# EAGLE design DAC_GainOutputStage4 (EAGLE 9.6.2)
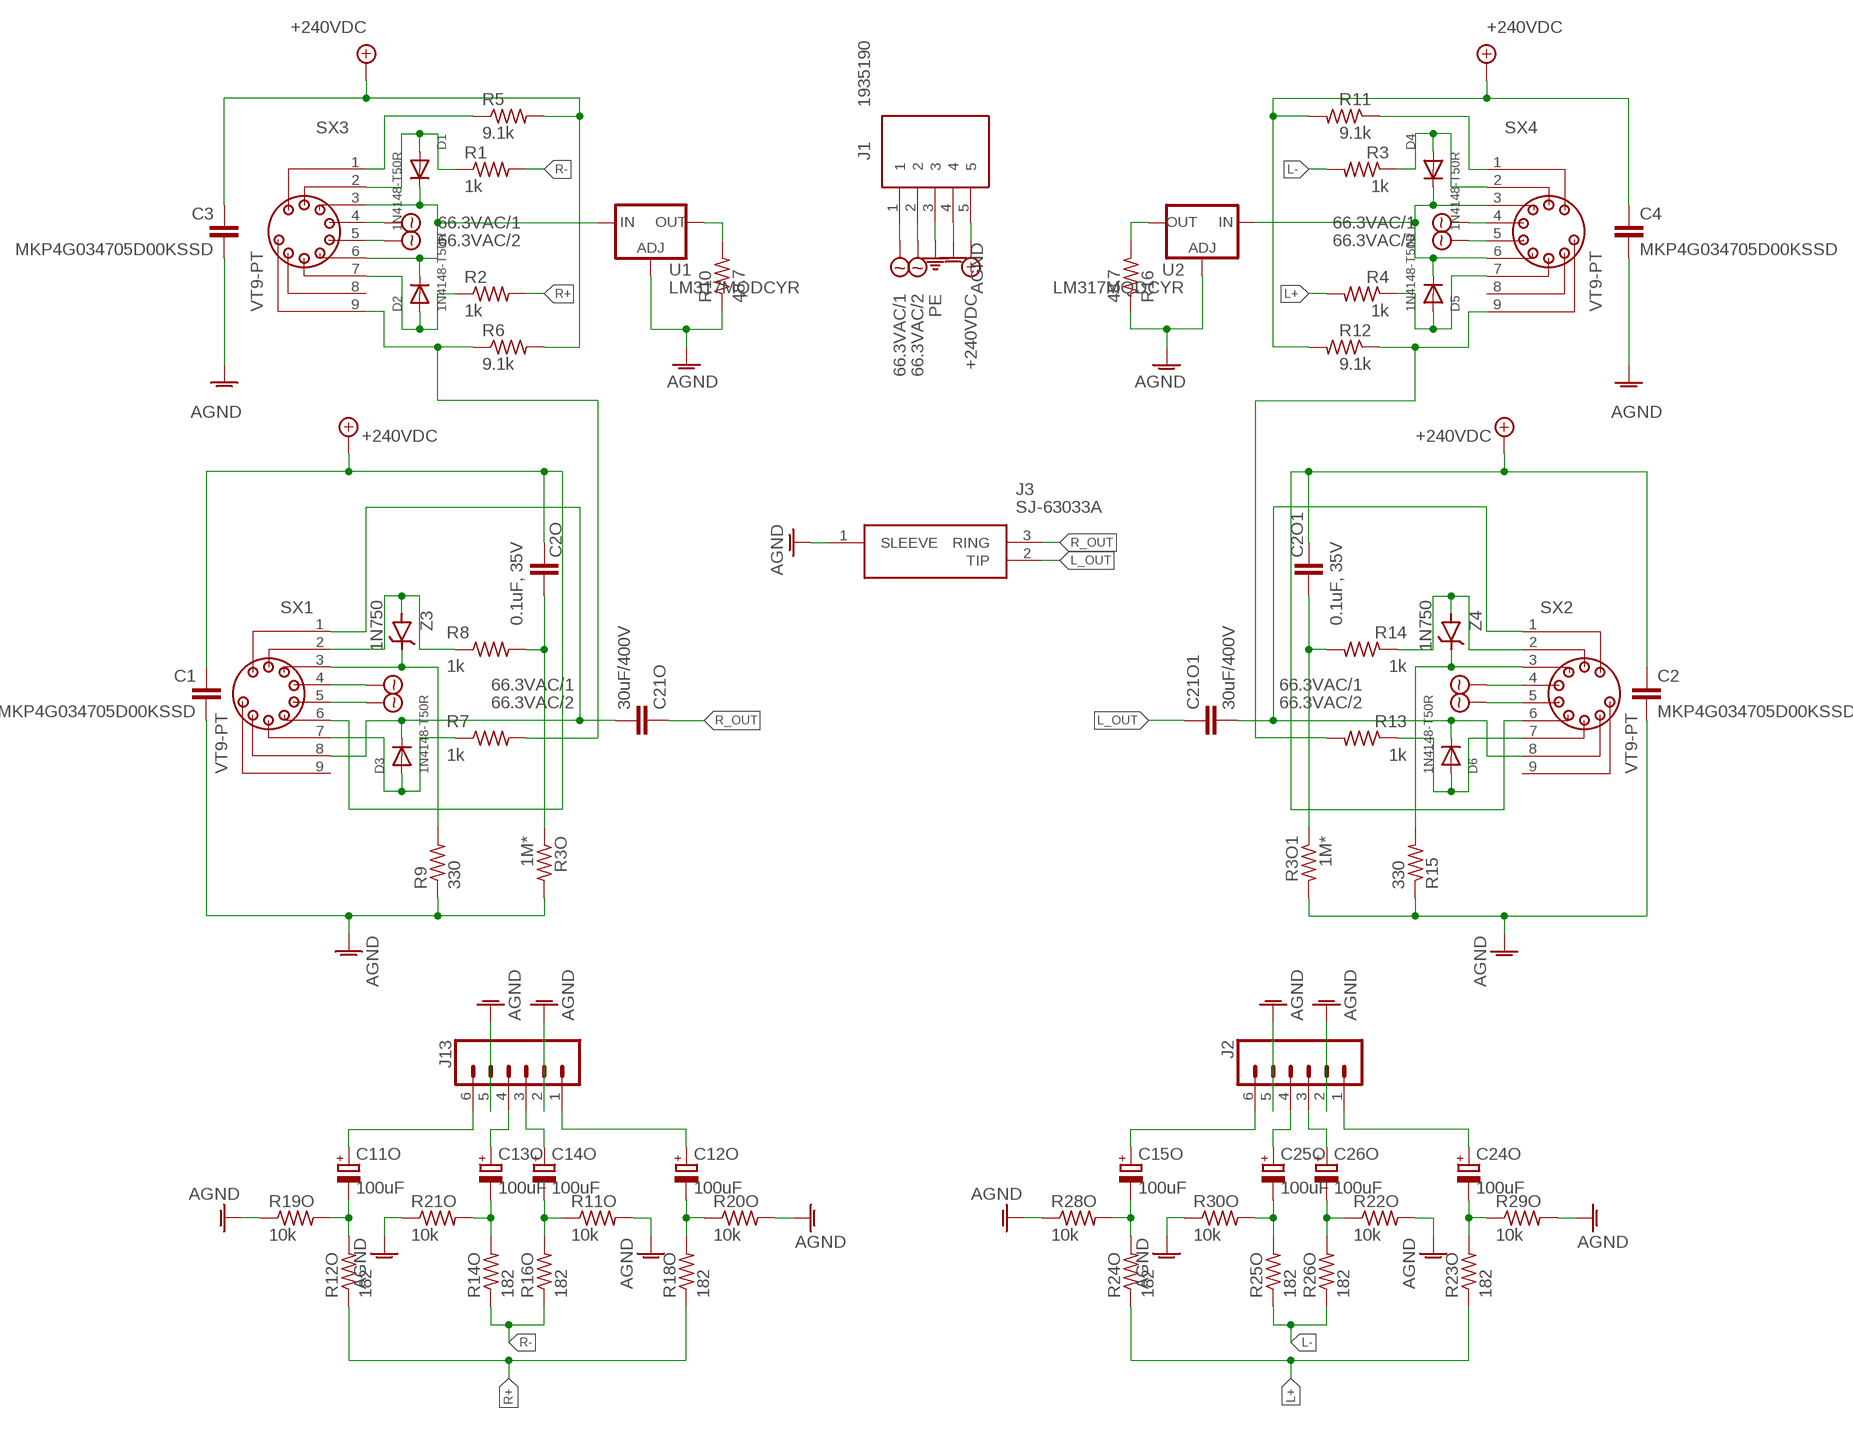
[diagram p0: schematic, sheet 1]

## Parts
C1  MKP4G034705D00KSSD  [MKP4G034705D00KSSD]
C2  MKP4G034705D00KSSD  [MKP4G034705D00KSSD]
C2O  0.1uF, 35V  MKS4B031002A00JC00  [MKS4B031002A00JC00]
C2O1  0.1uF, 35V  MKS4B031002A00JC00  [MKS4B031002A00JC00]
C3  MKP4G034705D00KSSD  [MKP4G034705D00KSSD]
C4  MKP4G034705D00KSSD  [MKP4G034705D00KSSD]
C11O  100uF  UFW1H101MPD1TD  [CAPPRD350W60D825H1300]
C12O  100uF  UFW1H101MPD1TD  [CAPPRD350W60D825H1300]
C13O  100uF  UFW1H101MPD1TD  [CAPPRD350W60D825H1300]
C14O  100uF  UFW1H101MPD1TD  [CAPPRD350W60D825H1300]
C15O  100uF  UFW1H101MPD1TD  [CAPPRD350W60D825H1300]
C21O  30uF/400V  DCP4G053006ID2KSSD  [DCP4G053006ID2KSSD]
C21O1  30uF/400V  DCP4G053006ID2KSSD  [DCP4G053006ID2KSSD]
C24O  100uF  UFW1H101MPD1TD  [CAPPRD350W60D825H1300]
C25O  100uF  UFW1H101MPD1TD  [CAPPRD350W60D825H1300]
C26O  100uF  UFW1H101MPD1TD  [CAPPRD350W60D825H1300]
D1  1N4148-T50R  [DIOAD1068W53L380D172]
D2  1N4148-T50R  [DIOAD1068W53L380D172]
D3  1N4148-T50R  [DIOAD1068W53L380D172]
D4  1N4148-T50R  [DIOAD1068W53L380D172]
D5  1N4148-T50R  [DIOAD1068W53L380D172]
D6  1N4148-T50R  [DIOAD1068W53L380D172]
J1  1935190  [1935190]
J2  CONN_06SILK_FEMALE_PTH  [1X06]
J3  SJ-63033A  [SJ63033A]
J13  CONN_06SILK_FEMALE_PTH  [1X06]
R1  1k  LR1F1K0  [0207/10]
R2  1k  LR1F1K0  [0207/10]
R3  1k  LR1F1K0  [0207/10]
R3O  1M*  LR1F1M0  [0207/10]
R3O1  1M*  LR1F1M0  [0207/10]
R4  1k  LR1F1K0  [0207/10]
R5  9.1k  PR02000209101FA100  [0411/15]
R6  9.1k  PR02000209101FA100  [0411/15]
R7  1k  LR1F1K0  [0207/10]
R8  1k  LR1F1K0  [0207/10]
R9  330  LR1F330R  [0207/10]
R10  48.7  R-US_0207/10  [0207/10]
R11  9.1k  PR02000209101FA100  [0411/15]
R11O  10k  LR1F10K  [0207/10]
R12  9.1k  PR02000209101FA100  [0411/15]
R12O  182  MF0207FTE52-182R  [0207/10]
R13  1k  LR1F1K0  [0207/10]
R14  1k  LR1F1K0  [0207/10]
R14O  182  MF0207FTE52-182R  [0207/10]
R15  330  LR1F330R  [0207/10]
R16  48.7  R-US_0207/10  [0207/10]
R16O  182  MF0207FTE52-182R  [0207/10]
R18O  182  MF0207FTE52-182R  [0207/10]
R19O  10k  LR1F10K  [0207/10]
R20O  10k  LR1F10K  [0207/10]
R21O  10k  LR1F10K  [0207/10]
R22O  10k  LR1F10K  [0207/10]
R23O  182  MF0207FTE52-182R  [0207/10]
R24O  182  MF0207FTE52-182R  [0207/10]
R25O  182  MF0207FTE52-182R  [0207/10]
R26O  182  MF0207FTE52-182R  [0207/10]
R28O  10k  LR1F10K  [0207/10]
R29O  10k  LR1F10K  [0207/10]
R30O  10k  LR1F10K  [0207/10]
SX1  VT9-PT  [VT9-PT]
SX2  VT9-PT  [VT9-PT]
SX3  VT9-PT  [VT9-PT]
SX4  VT9-PT  [VT9-PT]
U1  LM317MQDCYR  [SOT230P700X180-4N]
U2  LM317MQDCYR  [SOT230P700X180-4N]
Z3  1N750  [DIOAD1256W56L444D203]
Z4  1N750  [DIOAD1256W56L444D203]

## Nets
66.3VAC/1 [Power]: J1.1 SX1.4 SX2.4 SX3.4 SX4.4
66.3VAC/2 [Power]: J1.2 SX1.5 SX2.5 SX3.5 SX4.5
+240VDC [Power]: C1.1 C2.1 C2O1.1 C2O.1 C3.1 C4.1 J1.5 R5.2 R6.2 R11.2 R12.2 SX1.6 SX2.6
AGND [Power]: C1.2 C2.2 C3.2 C4.2 J1.4 J2.2 J2.5 J3.1(SLEEVE) J13.2 J13.5 R3O1.2 R3O.2 R9.1 R10.1 R11O.2 R15.1 R16.1 R19O.1 R20O.2 R21O.1 R22O.2 R28O.1 R29O.2 R30O.1 U1.1(ADJ) U2.1(ADJ)
L+ [Signal]: R4.2 R23O.1 R24O.1
L- [Signal]: R3.2 R25O.1 R26O.1
L_OUT [Signal]: C21O1.1 J3.2(TIP)
N$1: R6.1 R7.2 SX3.9
N$2: R8.1 SX1.2 Z3.2(A)
N$3: C21O1.2 D6.1(C) SX2.1 SX2.8
N$4: D4.2(A) R3.1 SX4.2
N$5: D5.2(A) R4.1 SX4.7
N$6: D1.2(A) R1.1 SX3.2
N$7 [Power]: D4.1(C) D5.1(C) SX4.3 SX4.6 U2.3(IN)
N$8: R11.1 SX4.1
N$9: R12.1 R13.2 SX4.9
N$10: C11O.1(+) J13.6
N$11: C11O.2(-) R12O.2 R19O.2
N$12: C15O.1(+) J2.6
N$13: D2.2(A) R2.1 SX3.7
N$14: R14.1 SX2.2 Z4.2(A)
N$15: C12O.1(+) J13.1
N$16: C2O.2 R3O.1 R8.2
N$17: C2O1.2 R3O1.1 R14.2
N$18: C21O.2 D3.1(C) SX1.1 SX1.8
N$19: C12O.2(-) R18O.2 R20O.1
N$20: C15O.2(-) R24O.2 R28O.2
N$21: C13O.1(+) J13.4
N$22 [Power]: D1.1(C) D2.1(C) SX3.3 SX3.6 U1.3(IN)
N$23: D3.2(A) R7.1 SX1.7
N$24: C14O.1(+) J13.3
N$25: C14O.2(-) R11O.1 R16O.2
N$26: R9.2 SX1.3 Z3.1(C)
N$27: R15.2 SX2.3 Z4.1(C)
N$28: C13O.2(-) R14O.2 R21O.2
N$29: D6.2(A) R13.1 SX2.7
N$30: C24O.1(+) J2.1
N$31: C24O.2(-) R23O.2 R29O.1
N$32: C25O.1(+) J2.4
N$33: C26O.1(+) J2.3
N$34: C26O.2(-) R22O.1 R26O.2
N$35: R5.1 SX3.1
N$36: C25O.2(-) R25O.2 R30O.2
N$37: R10.2 U1.2(OUT) U1.4(OUT)
N$38: R16.2 U2.2(OUT) U2.4(OUT)
PE [Power]: J1.3
R+ [Signal]: R2.2 R12O.1 R18O.1
R- [Signal]: R1.2 R14O.1 R16O.1
R_OUT [Signal]: C21O.1 J3.3(RING)
Unconnected: SX1.9 SX2.9 SX3.8 SX4.8

## Library data of the parts
C1-C4 = Dual Mono Amp Library:MKP4G034705D00KSSD: 0.47 F Film Capacitor 220V 400V Polypropylene (PP), Metallized Radial Source: Datasheet <https://www.wima.de/wp-content/uploads/media/e_WIMA_MKP_4.pdf>; DESCRIPTION: 0.47 F Film Capacitor 220V 400V Polypropylene (PP), Metallized Radial; HEIGHT: 16.5mm; MANUFACTURER_NAME: WIMA; MANUFACTURER_PART_NUMBER: MKP4G034705D00KSSD; MOUSER_PART_NUMBER: 505-MKP4G034705DKSSD; MOUSER_PRICE-STOCK: http://www.mouser.com/Search/ProductDetail.aspx?qs=sJjjjplDs9uaOctv9bTMfA%3d%3d
C2O C2O1 = Dual Mono Amp Library:MKS4B031002A00JC00: Film Capacitors MKS 4 0.1 uF 50 VDC 2.5x7x10 PCM 7.5 Source: Datasheet <https://www.wima.de/wp-content/uploads/media/e_WIMA_MKS_4.pdf>; DESCRIPTION: Film Capacitors MKS 4 0.1 uF 50 VDC 2.5x7x10 PCM 7.5; HEIGHT: 7mm; MANUFACTURER_NAME: WIMA; MANUFACTURER_PART_NUMBER: MKS4B031002A00JC00; MOUSER_PART_NUMBER: 505-MKS4B0312AJC; MOUSER_PRICE-STOCK: https://www.mouser.co.uk/ProductDetail/WIMA/MKS4B031002A00JC00?qs=2G4irm%2FqADy9MV8AUfKNYA%3D%3D
C11O C12O C13O C14O C15O C24O C25O C26O = Dual Mono Amp Library:UFW1H101MPD1TD: Aluminum Electrolytic Capacitors - Radial Leaded 100uF 50 Volts 20% Source: Datasheet <https://www.nichicon.co.jp/english/series_items/catalog_pdf/e-ufw.pdf>; ARROW_PART_NUMBER: UFW1H101MPD1TD; ARROW_PRICE-STOCK: https://www.arrow.com/en/products/ufw1h101mpd1td/nichicon; DESCRIPTION: Aluminum Electrolytic Capacitors - Radial Leaded 100uF 50 Volts 20%; HEIGHT: 13mm; MANUFACTURER_NAME: Nichicon; MANUFACTURER_PART_NUMBER: UFW1H101MPD1TD; MOUSER_PART_NUMBER: 647-UFW1H101MPD1TD; MOUSER_PRICE-STOCK: https://www.mouser.co.uk/ProductDetail/Nichicon/UFW1H101MPD1TD?qs=WJSLByB5Mu30jPPJ2KiG3A%3D%3D
C21O C21O1 = Dual Mono Amp Library:DCP4G053006ID2KSSD: Film Capacitors DC-LINK MKP 4 30.0 uF 400 VDC 17x34.5x31.5 PCM 27.5 Source: Datasheet <https://www.wima.de/wp-content/uploads/media/e_WIMA_DC_Link_MKP_4.pdf>; DESCRIPTION: Film Capacitors DC-LINK MKP 4 30.0 uF 400 VDC 17x34.5x31.5 PCM 27.5; HEIGHT: 34.5mm; MANUFACTURER_NAME: WIMA; MANUFACTURER_PART_NUMBER: DCP4G053006ID2KSSD; MOUSER_PART_NUMBER: 505-DCP4G0536ID2KSSD; MOUSER_PRICE-STOCK: https://www.mouser.co.uk/ProductDetail/WIMA/DCP4G053006ID2KSSD?qs=RB4whv9F6rwxZ2Ey0tRejg%3D%3D
D1-D6 = Dual Mono Amp Library:1N4148-T50R: Diodes - General Purpose, Power, Switching Hi Conductance Fast Source: Datasheet <https://www.onsemi.com/pub/Collateral/1N914-D.PDF>; DESCRIPTION: Diodes - General Purpose, Power, Switching Hi Conductance Fast; HEIGHT: mm; MANUFACTURER_NAME: onsemi; MANUFACTURER_PART_NUMBER: 1N4148-T50R; MOUSER_PART_NUMBER: 512-1N4148T50R; MOUSER_PRICE-STOCK: https://www.mouser.co.uk/ProductDetail/onsemi-Fairchild/1N4148-T50R?qs=0lQeLiL1qyZS6rosZp7Ehg%3D%3D
J1 = Dual Mono Amp Library:1935190: PCB terminal block, nominal current: 17.5 A, rated voltage (III/2): 400 V, nominal cross section: 1.5 mm?, Number of potentials: 5, Number of rows: 1, Number of positions per row: 5, product range: PT 1,5/..-H, pitch: 5 mm, connection method: Screw connection with wire protector, mounting: Wave soldering, conductor/PCB connection direction: 0 ?, color: green, Pin layout: Linear pinning, Solder pin [P]: 3.5 mm, type of packaging: packed in cardboard Source: Datasheet <https://www.phoenixcontact.com/online/portal/us/pxc/product_detail_page/!ut/p/z1/3Vdbc5pAFP4r5sG3rLsLLEJn-oDGlJjEYsQqvDDssma24RZETf31Xbyk1Wn1IeN0CnNm2D2c853L8jEc6MMp9NNwKZ7DUmRpGMu95-uB23F7PUfR8dch6aC7G9LtPWhP2B4o8Bv0oV-GFHq4WsWCFmHxA3qLOU8rRS4i-chUCTZRtc>; DESCRIPTION: PCB terminal block, nominal current: 17.5 A, rated voltage (III/2): 400 V, nominal cross section: 1.5 mm?, Number of potentials: 5, Number of rows: 1, Number of positions per row: 5, product range: PT 1,5/..-H, pitch: 5 mm, connection method: Screw connection with wire protector, mounting: Wave soldering, conductor/PCB connection direction: 0 ?, color: green, Pin layout: Linear pinning, Solder pin [P]: 3.5 mm, type of packaging: packed in cardboard; HEIGHT: 11.55mm; MANUFACTURER_NAME: Phoenix Contact; MANUFACTURER_PART_NUMBER: 1935190; MOUSER_PART_NUMBER: 651-1935190; MOUSER_PRICE-STOCK: https://www.mouser.co.uk/ProductDetail/Phoenix-Contact/1935190?qs=QWULklcAmSS%2FS46GSzyZOw%3D%3D
J2 J13 = Dual Mono Amp Library:CONN_06: Multi connection point. Often used as Generic Header-pin footprint for 0.1 inch spaced/style header connections On any of the 0.1 inch spaced packages, you can populate with these: Break Away Headers - Straight <https://www.sparkfun.com/products/116> (PRT-00116) Break Away Male Headers - Right Angle <https://www.sparkfun.com/products/553> (PRT-00553) Female Headers <https://www.sparkfun.com/products/115> (PRT-00115) Break Away Headers - Machine Pin <https://www.sparkfun.com/products/117> (PRT-00117) Break Away Female Headers - Swiss Machine Pin <https://www.sparkfun.com/products/743> (PRT-00743) Arduino Stackable Header - 6 Pin <https://www.sparkfun.com/products/9280> (PRT-09280) Screw Terminals 2.54mm Pitch (6-Pin) <https://www.sparkfun.com/products/16499> (PRT-16499) For SCREWTERMINALS and SPRING TERMINALS visit here: Screw Terimnals on SparkFun.com <https://www.sparkfun.com/search/results?term=Screw+Terminals> (5mm/3.5mm/2.54mm spacing) This device is also useful as a general connection point to wire up your design to another part of your project. Our various solder wires solder well into these plated through hole pads. Hook-Up Wire - Assortment (Stranded, 22 AWG) <https://www.sparkfun.com/products/11375> (PRT-11375) Hook-Up Wire - Assortment (Solid Core, 22 AWG) <https://www.sparkfun.com/products/11367> (PRT-11367) View the entire wire category on our website here <https://www.sparkfun.com/categories/141>; PROD_ID: CONN-08437
J3 = Dual Mono Amp Library:SJ-63033A: 6.35 mm, Stereo, Right Angle, Through Hole Mount, 3 Conductors, 0 Internal Switches, Audio Jack Connector Source: Datasheet <https://www.cuidevices.com/product/resource/sj-63033a.pdf>; DESCRIPTION: 6.35 mm, Stereo, Right Angle, Through Hole Mount, 3 Conductors, 0 Internal Switches, Audio Jack Connector; HEIGHT: 12.3mm; MANUFACTURER_NAME: CUI Devices; MANUFACTURER_PART_NUMBER: SJ-63033A
R1-R4 R7 R8 R13 R14 = Dual Mono Amp Library:LR1F1K0: Body Features: Lead Type Axial-Leaded | Configuration Features: Number of Resistors 1 | Dimensions: Passive Component Dimensions 6.2 x 2.3 MM | Electrical Characteristics: Passive Component Tolerance 1 PCT | Resistance Value 1K OHM | Operating Voltage 350 V | Power Rating .6 WATT | Resistance Class 1k 1M | Packaging Features: Packaging Method Ammo Packed | Product Type Features: Element Type Thin Film | Resistor Type General Purpose Resistor | Termination Features: Termination Area Base Material Cop Source: Datasheet <https://www.te.com/commerce/DocumentDelivery/DDEController?Action=srchrtrv&DocNm=1773241&DocType=Data Sheet&DocLang=English&PartCntxt=1622349-1&DocFormat=pdf>; DESCRIPTION: Body Features: Lead Type Axial-Leaded | Configuration Features: Number of Resistors 1 | Dimensions: Passive Component Dimensions 6.2 x 2.3 MM | Electrical Characteristics: Passive Component Tolerance 1 PCT | Resistance Value 1K OHM | Operating Voltage 350 V | Power Rating .6 WATT | Resistance Class 1k 1M | Packaging Features: Packaging Method Ammo Packed | Product Type Features: Element Type Thin Film | Resistor Type General Purpose Resistor | Termination Features: Termination Area Base Material Cop; HEIGHT: mm; MANUFACTURER_NAME: TE Connectivity; MANUFACTURER_PART_NUMBER: LR1F1K0; MOUSER_PART_NUMBER: 279-LR1F1K0; MOUSER_PRICE-STOCK: https://www.mouser.co.uk/ProductDetail/TE-Connectivity-Holsworthy/LR1F1K0?qs=ip69W3eHERVhMxNSZkerTg%3D%3D
R3O R3O1 = Dual Mono Amp Library:LR1F1M0: TE Connectivity Axial Metal Film Resistor 1m +/-1% 0.6W +/-50ppm/C Source: Datasheet <https://www.te.com/commerce/DocumentDelivery/DDEController?Action=showdoc&DocId=Data Sheet1773241GpdfEnglishENG_DS_1773241_G.pdf1622367-1>; DESCRIPTION: TE Connectivity Axial Metal Film Resistor 1m +/-1% 0.6W +/-50ppm/C; HEIGHT: mm; MANUFACTURER_NAME: TE Connectivity; MANUFACTURER_PART_NUMBER: LR1F1M0; MOUSER_PART_NUMBER: 279-LR1F1M0; MOUSER_PRICE-STOCK: https://www.mouser.co.uk/ProductDetail/TE-Connectivity-Holsworthy/LR1F1M0?qs=ip69W3eHERVt%2FmQVAugcSg%3D%3D
R5 R6 R11 R12 = Dual Mono Amp Library:PR02000209101FA100: VISHAY - PR02000209101FA100 - Through Hole Resistor, 9.1 kohm, PR02 Series, 2 W, +/- 5%, Axial Leaded, 500 V Source: Datasheet <https://www.vishay.com/doc?28729>; DESCRIPTION: VISHAY - PR02000209101FA100 - Through Hole Resistor, 9.1 kohm, PR02 Series, 2 W, +/- 5%, Axial Leaded, 500 V; HEIGHT: mm; MANUFACTURER_NAME: Vishay; MANUFACTURER_PART_NUMBER: PR02000209101FA100; MOUSER_PART_NUMBER: 594-PR02000209101FA1; MOUSER_PRICE-STOCK: https://www.mouser.com/ProductDetail/Vishay-BC-Components/PR02000209101FA100?qs=sGAEpiMZZMtlubZbdhIBILAdz%2F2y2rDs5x9O1ZBVKlg%3D
R9 R15 = Dual Mono Amp Library:LR1F330R: Body Features: Lead Type Axial-Leaded | Configuration Features: Number of Resistors 1 | Dimensions: Passive Component Dimensions 6.2 x 2.3 MM | Electrical Characteristics: Resistance Value 330 OHM | Power Rating .6 WATT | Passive Component Tolerance 1 PCT | Operating Voltage 350 V | Resistance Class Up to 1k | Packaging Features: Packaging Method Ammo Packed | Product Type Features: Resistor Type General Purpose Resistor | Element Type Thin Film | Termination Features: Number of Terminations 2 | Terminati Source: Datasheet <https://www.te.com/commerce/DocumentDelivery/DDEController?Action=srchrtrv&DocNm=1773241&DocType=Data Sheet&DocLang=English&PartCntxt=1622438-1&DocFormat=pdf>; DESCRIPTION: Body Features: Lead Type Axial-Leaded | Configuration Features: Number of Resistors 1 | Dimensions: Passive Component Dimensions 6.2 x 2.3 MM | Electrical Characteristics: Resistance Value 330 OHM | Power Rating .6 WATT | Passive Component Tolerance 1 PCT | Operating Voltage 350 V | Resistance Class Up to 1k | Packaging Features: Packaging Method Ammo Packed | Product Type Features: Resistor Type General Purpose Resistor | Element Type Thin Film | Termination Features: Number of Terminations 2 | Terminati; HEIGHT: mm; MANUFACTURER_NAME: TE Connectivity; MANUFACTURER_PART_NUMBER: LR1F330R; MOUSER_PART_NUMBER: 279-LR1F330R; MOUSER_PRICE-STOCK: https://www.mouser.co.uk/ProductDetail/TE-Connectivity-Holsworthy/LR1F330R?qs=ip69W3eHERU18wOSJKTVaQ%3D%3D
R10 R16 = Dual Mono Amp Library:R-US_: RESISTOR, American symbol; SPICEPREFIX: R
R11O R19O R20O R21O R22O R28O R29O R30O = Dual Mono Amp Library:LR1F10K: Metal film resistor, 10K 0.6W TE Connectivity LR1F Series Axial Metal Film Resistor 10k Source: Datasheet <https://datasheet.datasheetarchive.com/originals/distributors/DKDS-21/401716.pdf>; DESCRIPTION: Metal film resistor, 10K 0.6W TE Connectivity LR1F Series Axial Metal Film Resistor 10k; HEIGHT: mm; MANUFACTURER_NAME: TE Connectivity; MANUFACTURER_PART_NUMBER: LR1F10K; MOUSER_PART_NUMBER: 279-LR1F10K; MOUSER_PRICE-STOCK: https://www.mouser.co.uk/ProductDetail/TE-Connectivity-Holsworthy/LR1F10K?qs=ip69W3eHERWDLLWs2Qv0Lg%3D%3D
R12O R14O R16O R18O R23O R24O R25O R26O = Dual Mono Amp Library:MF0207FTE52-182R: Metal Film Resistors - Through Hole 0.6W 1% 182 ohm 50pp m Source: Datasheet <https://www.mouser.com/datasheet/2/447/YAGEO_MF0_datasheet_2021v1-3003020.pdf>; DESCRIPTION: Metal Film Resistors - Through Hole 0.6W 1% 182 ohm 50pp m; HEIGHT: mm; MANUFACTURER: Yageo; MANUFACTURER_PART_NUMBER: MF0207FTE52-182R; MOUSER_PART_NUMBER: 603-MF0207FTE52-182R; MOUSER_PRICE-STOCK: https://www.mouser.com/ProductDetail/YAGEO/MF0207FTE52-182R?qs=KUIzHt%2Fe91leK267FaM40g%3D%3D
SX1-SX4 = Dual Mono Amp Library:VT9: VACUUM TUBE SOCKET Source: 00004280-VT9-PT.pdf
U1 U2 = Dual Mono Amp Library:LM317MQDCYR: Standard Regulator 1.25V to 37V 0.5A Texas Instruments LM317MQDCYR, Single Linear Voltage Regulator, 500mA Adjustable 1.25 37 V, 4-Pin SOT-223 Source: Datasheet <https://componentsearchengine.com/Datasheets/2/LM317MQDCYR.pdf>; DESCRIPTION: Standard Regulator 1.25V to 37V 0.5A Texas Instruments LM317MQDCYR, Single Linear Voltage Regulator, 500mA Adjustable 1.25 37 V, 4-Pin SOT-223; HEIGHT: 1.8mm; MANUFACTURER_NAME: Texas Instruments; MANUFACTURER_PART_NUMBER: LM317MQDCYR; MOUSER_PART_NUMBER: 595-LM317MQDCYR; MOUSER_PRICE-STOCK: https://www.mouser.co.uk/ProductDetail/Texas-Instruments/LM317MQDCYR?qs=VBduBm9rCJSAPGr9YDjocQ%3D%3D
Z3 Z4 = Dual Mono Amp Library:1N750: Zener Diodes Voltage Regulator Source: Datasheet <https://www.microsemi.com/document-portal/doc_view/10928-sa5-7-datasheet>; DESCRIPTION: Zener Diodes Voltage Regulator; HEIGHT: mm; MANUFACTURER_NAME: Microsemi Corporation; MANUFACTURER_PART_NUMBER: 1N750; MOUSER_PART_NUMBER: 494-1N750(DO-35); MOUSER_PRICE-STOCK: https://www.mouser.co.uk/ProductDetail/Microchip-Microsemi/1N750?qs=Xwz%252BGKGy4sB1rzIdx4SmVg%3D%3D

## Net classes
1 Signal: width 1.272 mm
2 Power: width 2.54 mm

## Board
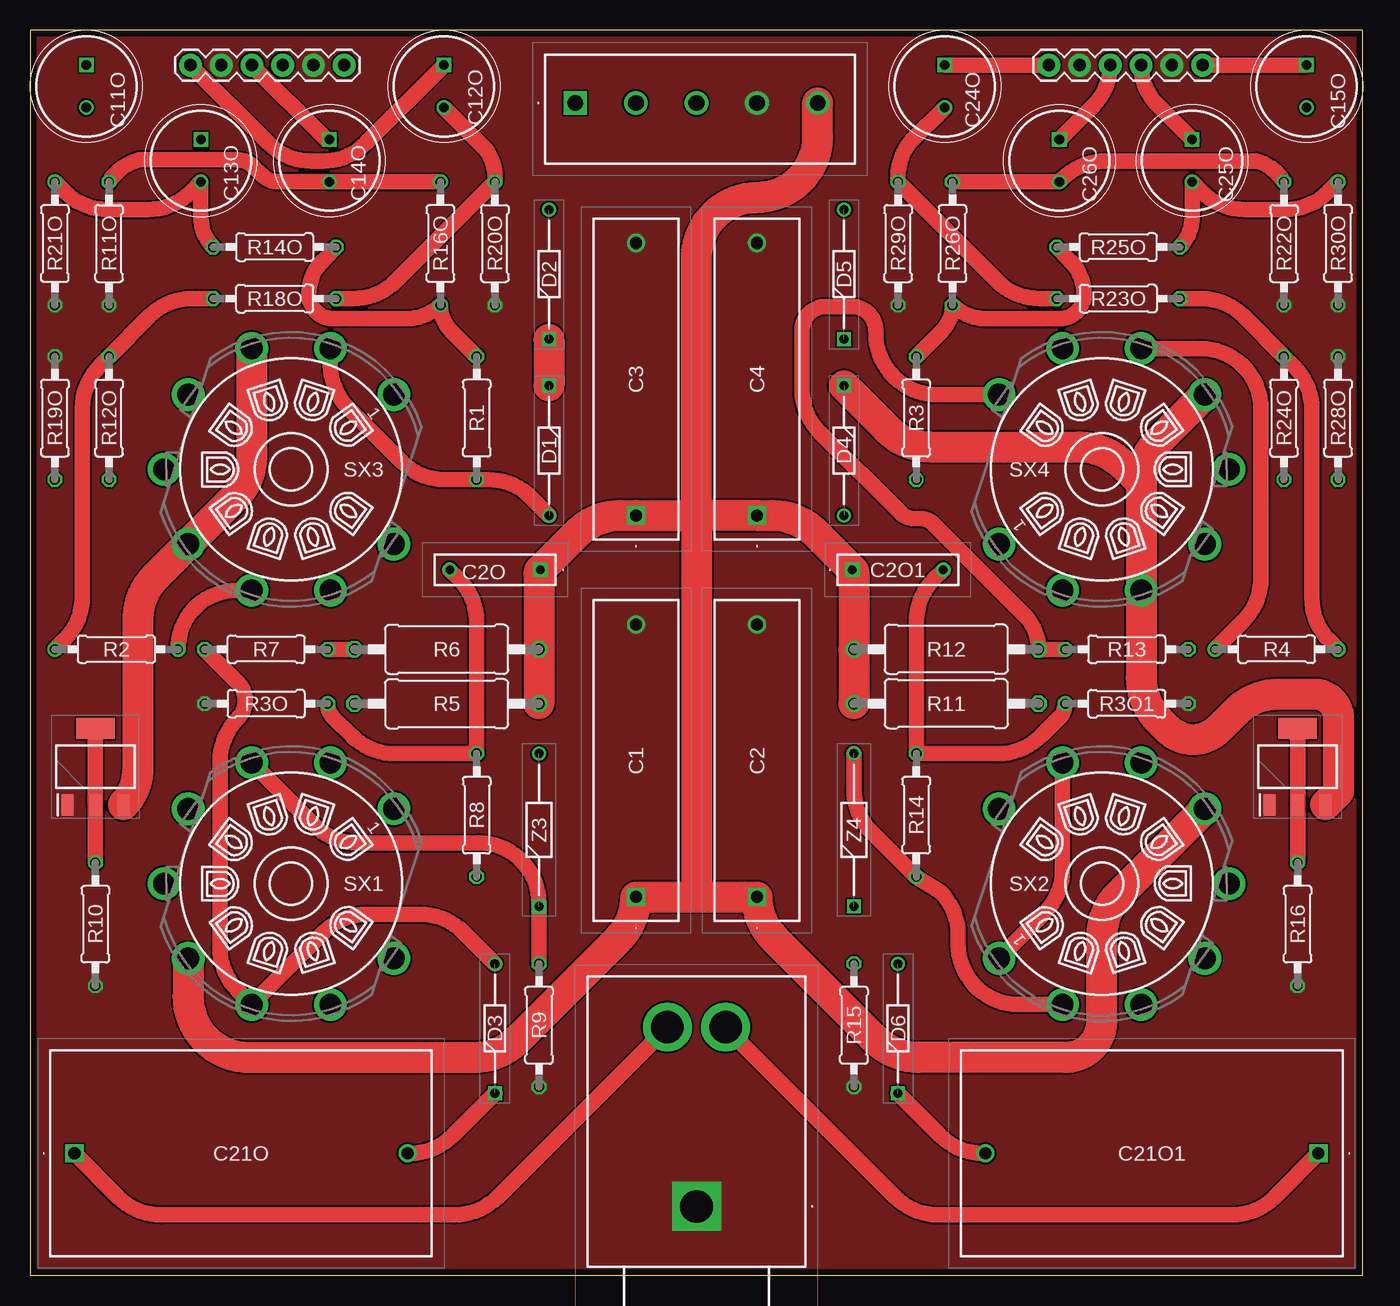
[diagram p1: board, top side]
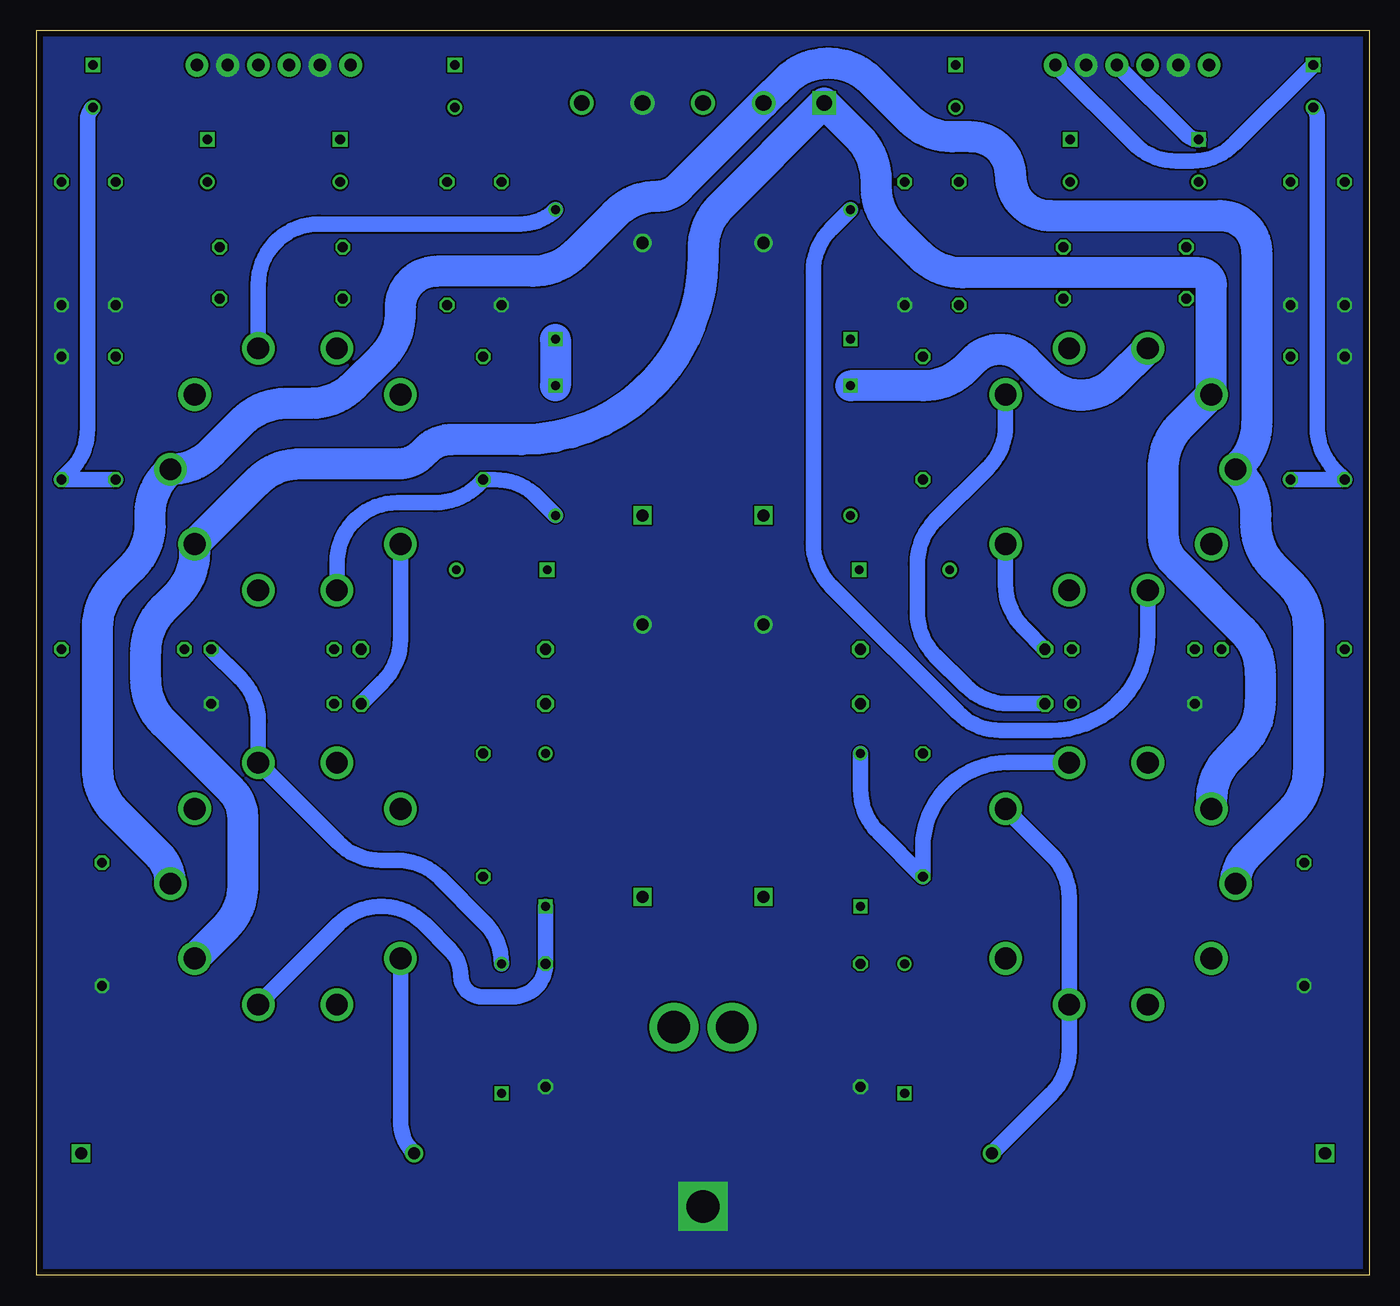
[diagram p2: board, bottom side, seen from below]

Size 110 x 102.8 mm. Coordinates in mm from the lower left corner, seen from the top.
Outline: 0,0 110,0 110,102.8 0,102.8 0,0
Copper layers (1*16): Top 0.035mm / dielectric 1.6mm / Bottom 0.035mm
Design rules "Elecrow_2-layer_PCB_eagle_rule": minimum track width 6mil, minimum drill 12mil, track to track 6mil, track to pad 6mil, pad to pad 6mil, via to via 8mil, smd to smd 0mil, copper to edge 20mil, drill to drill 10mil, minimum pad ring 6mil, minimum via ring 6mil, stop-mask expansion 0mil, vias tented up to drill 100mil, thermal gap 10mil

### Footprints (pad centres in the part's own frame; a part is rotated, then mirrored left to right if it is on the bottom)
MKP4G034705D00KSSD = drill 1 pad 1.5 square: 1 0,0 | drill 1 pad 1.5: 2 22.5,0
MKS4B031002A00JC00 = drill 0.7 pad 1.2 square: 1 0,0 | drill 0.7 pad 1.2: 2 7.5,0
CAPPRD350W60D825H1300 = drill 0.8 pad 1.2 square: 1 0,0 | drill 0.8 pad 1.2: 2 3.5,0
DCP4G053006ID2KSSD = drill 1 pad 1.5 square: 1 0,0 | drill 1 pad 1.5: 2 27.5,0
DIOAD1068W53L380D172 = drill 0.75 pad 1.15 square: 1 0,0 | drill 0.75 pad 1.15: 2 10.7,0
1935190 = drill 1.3 pad 1.95 square: 1 0,0 | drill 1.3 pad 1.95: 2 5,0; 3 10,0; 4 15,0; 5 20,0
1X06 = drill 1.016 pad 1.88: 1 0,0; 2 2.54,0; 3 5.08,0; 4 7.62,0; 5 10.16,0; 6 12.7,0
SJ63033A = drill 2.69 pad 4.035 square: 1 0,0 | drill 2.69 pad 4.035: 2 14.8,-2.4; 3 14.8,2.4
0207/10 = drill 0.813 octagon: 1 -5.08,0; 2 5.08,0
0411/15 = drill 0.914 octagon: 1 -7.62,0; 2 7.62,0
VT9-PT = drill 1.8 pad 2.4: 1 6.172,8.495; 2 0,10.5; 3 -6.172,8.495; 4 -9.986,3.245; 5 -9.986,-3.245; 6 -6.172,-8.495; 7 0,-10.5; 8 6.172,-8.495; 9 9.986,-3.244
SOT230P700X180-4N = smd 1.75 x 0.95: 1 -3.15,2.3; 2 -3.15,0; 3 -3.15,-2.3 | smd 1.75 x 3.2: 4 3.15,0
DIOAD1256W56L444D203 = drill 0.75 pad 1.15 square: 1 0,0 | drill 0.75 pad 1.15: 2 12.6,0

### Placement (x,y rotation side)
C1  50,31.25 90 top
C2  60,31.25 90 top
C2O  42.12,58.25 180 top
C2O1  67.88,58.25 0 top
C3  50,62.75 90 top
C4  60,62.75 90 top
C11O  4.62,99.92 270 top
C12O  34.15,99.92 270 top
C13O  14.08,93.78 270 top
C14O  24.69,93.78 270 top
C15O  105.38,99.92 270 top
C21O  3.65,10.08 0 top
C21O1  106.35,10.08 180 top
C24O  75.5,99.92 270 top
C25O  95.92,93.78 270 top
C26O  84.96,93.78 270 top
D1  42.83,73.45 270 top
D2  42.83,77.3 90 top
D3  38.35,15.04 90 top
D4  67.17,73.45 270 top
D5  67.17,77.3 90 top
D6  71.65,15.04 90 top
J1  45,96.8 0 top
J2  84.09,99.92 0 top
J3  55,5.7 90 top
J13  13.21,99.92 0 top
R1  36.85,70.78 90 top
R2  7.11,51.7 180 top
R3  73.15,70.78 90 top
R3O  19.48,47.2 180 top
R3O1  90.52,47.2 0 top
R4  102.89,51.7 0 top
R5  34.38,47.2 0 top
R6  34.38,51.7 0 top
R7  19.48,51.7 0 top
R8  36.85,38 90 top
R9  42,20.66 90 top
R10  5.38,29 90 top
R11  75.62,47.2 180 top
R11O  6.5,85.2 270 top
R12  75.62,51.7 180 top
R12O  6.5,70.78 270 top
R13  90.52,51.7 180 top
R14  73.15,38 90 top
R14O  20.18,84.9 180 top
R15  68,20.66 90 top
R16  104.62,29 90 top
R16O  33.86,85.2 90 top
R18O  20.18,80.65 0 top
R19O  2.03,70.78 270 top
R20O  38.35,85.2 270 top
R21O  2.03,85.2 90 top
R22O  103.5,85.2 270 top
R23O  89.82,80.65 180 top
R24O  103.5,70.78 270 top
R25O  89.82,84.9 0 top
R26O  76.14,85.2 90 top
R28O  107.97,70.78 270 top
R29O  71.65,85.2 270 top
R30O  107.97,85.2 90 top
SX1  21.53,32.35 342 top
SX2  88.47,32.35 162 top
SX3  21.53,66.55 342 top
SX4  88.47,66.55 162 top
U1  5.38,42 90 top
U2  104.62,42 90 top
Z3  42,30.48 90 top
Z4  68,30.48 90 top

### Tracks (layer width: path | path; a pad name or v marks a point on that pad's centre or on a via)
66.3VAC/1
  Bottom 2.54: SX2.4 94.46,28.68 arc-45 93,32.22 93,37.86 arc-45 93.88,39.98 99.54,45.64 arc45 101,49.17 101,51.53 arc45 99.54,55.06 98.43,56.17 arc-45 96.97,59.7 SX4.4 91.81,65.54 arc45 88.27,67 80.16,67 arc-45 78.18,67.82 77.82,68.18 arc45 75.84,69 70,69 arc-90 55,84 55,84.73 arc45 53.54,88.26 J1.1 42.16,93.96 arc45 40.7,90.43 40.7,89.92 arc-45 39.24,86.39 37.09,84.24 arc-45 33.55,82.77 14.03,82.77 arc90 13.03,81.77 SX3.4 15.54,70.22 arc-45 17,66.68 17,61.04 arc-45 16.12,58.92 15.69,58.49 10.46,53.26 arc45 9,49.73 9,47.37 arc45 10.46,43.84 11.57,42.73 arc-45 13.03,39.2 SX1.4
66.3VAC/2
  Bottom 2.54: SX2.5 arc-45 99.96,34.74 103.54,38.31 arc45 105,41.85 105,53.53 arc45 103.54,57.06 102.12,58.48 arc-45 100.65,62.01 100.65,62.8 arc45 99.19,66.33 SX4.5 arc-45 95.56,67.96 92.99,70.54 arc45 89.45,72 87.37,72 arc-45 83.84,73.46 81.46,75.84 arc-45 80,79.37 80,79.9 arc90 77,82.9 69.07,82.9 arc-45 65.54,84.36 62.26,87.64 arc45 58.73,89.1 arc-45 56.97,89.83 J1.2 48.19,98.61 arc90 41.11,98.61 37.96,95.46 arc-45 34.43,94 32.85,94 arc90 29.6,90.75 arc-90 26.35,87.5 12.3,87.5 arc90 9.3,84.5 9.3,70.35 arc45 10.76,66.81 SX3.5 10.81,66.33 arc45 9.35,62.8 9.35,62.01 arc-45 7.88,58.48 6.46,57.06 arc45 5,53.53 5,41.85 arc45 6.46,38.31 10.04,34.74 arc-45 SX1.5
+240VDC
  Top 2.54: 55,62.75 C3.1 48.7,62.75 arc45 45.16,61.29 C2O.1 arc45 42,57.95 R6.2 R5.2 | 55,62.75 C4.1 61.3,62.75 arc-45 64.84,61.29 C2O1.1 arc-45 68,57.95 R12.2 R11.2 | 55,31.25 C1.1 arc-45 48.59,27.84 40.21,19.46 arc-45 36.68,18 18.03,18 arc-90 13.03,23 SX1.6 | 55,31.25 C2.1 arc45 61.41,27.84 69.79,19.46 arc45 73.32,18 85.47,18 arc90 88.47,21 88.47,27.96 arc-45 89.94,31.49 SX2.6 | J1.5 65,94 arc-90 60,89 arc90 55,84 55,62.75 | 55,62.75 55,31.25
AGND
  pour Bottom (rank 6, no thermals): 0,0 110,0 110,102.8 0,102.8
  pour Top (rank 6, no thermals): 0,0 110,0 110,102.8 0,102.8
L+
  Top 1.272: R23O.1 96.64,80.65 arc-45 100.18,79.18 R24O.1 104.34,75.03 arc-45 105.8,71.49 105.8,55.94 arc45 107.26,52.4 R4.2
L-
  Top 1.272: R3.2 75.25,77.97 arc45 R26O.1 arc45 78.84,79 85,79 arc90 87,81 arc45 85.84,83.8 R25O.1
L_OUT
  Top 1.272: J3.2 71.44,6.46 arc45 74.97,5 99.2,5 arc45 102.73,6.46 C21O1.1
N$1
  Top 1.272: R7.2 R6.1
  Bottom 1.272: SX3.9 30.02,57.03 arc-45 28.56,53.49 R6.1
N$2
  Bottom 1.272: Z3.2 42,40.14 arc-45 40.54,36.6 R8.1 36.85,35.34 arc90 29.86,42.34 SX1.2
N$3
  Top 1.272: SX2.8 85.23,33.5 arc-45 83.76,29.96 SX2.1 | D6.1 75.14,11.54 arc45 78.67,10.08 C21O1.2
  Bottom 1.272: SX2.1 79.98,12.8 arc-45 C21O1.2
N$4
  Bottom 1.272: SX4.2 85.23,58.81 arc90 80.23,63.81 77.11,63.81 arc-45 73.58,65.27 R3.1 72.2,65.7 arc45 68.66,64.24 D4.2
N$5
  Top 1.272: SX4.7 96.6,76.53 arc-90 101.6,71.53 101.6,57.56 arc-45 100.14,54.02 R4.1
  Bottom 1.272: SX4.7 91.72,81.81 arc90 86.72,86.81 70.05,86.81 arc-45 D5.2
N$6
  Top 1.272: SX3.2 24.77,75.16 arc45 26.24,71.63 30.7,67.17 arc45 34.23,65.7 R1.1 37.8,65.7 arc-45 41.34,64.24 D1.2
N$7
  Top 2.54: SX4.6 93.18,68.94 arc45 91.72,65.4 | 91.72,65.4 SX4.3 91.72,49.35 arc45 93.18,45.82 93.88,45.12 arc90 98.12,45.12 99.54,46.54 arc-45 103.07,48 106,48 arc-90 108,46 108,39.92 U2.3 | 91.72,65.4 90.18,66.94 arc45 86.65,68.4 74.3,68.4 arc-45 70.76,69.86 D4.1
  Bottom 2.54: D5.1 D4.1
N$8
  Bottom 1.272: SX4.1 79.98,52.54 arc45 81.44,49 R11.1
N$9
  Top 1.272: R13.2 R12.1 arc45 82.06,54.54 74.54,62.06 arc45 73.48,62.5 72.92,62.5 arc-45 71.86,62.94 65.16,69.64 arc-45 63.7,73.17 63.7,78 arc-90 65.7,80 67.8,80 arc-90 69.8,78 69.8,77.77 arc45 71.26,74.24 71.31,74.19 arc45 74.85,72.72 SX4.9
N$10
  Bottom 1.272: C11O.1 11.09,93.46 arc45 14.62,92 15.92,92 arc45 19.45,93.46 J13.6
N$11
  Bottom 1.272: C11O.2 arc45 4.3,95.64 4.3,70.04 arc-45 2.84,66.51 R19O.2 R12O.2
N$12
  Top 1.272: J2.6 C15O.1
N$13
  Top 1.272: R2.1 arc-90 17.06,56.56 SX3.7
  Bottom 1.272: D2.2 44.44,86.39 arc-45 45.9,82.85 45.9,60.47 arc-45 44.44,56.94 33.96,46.46 arc-45 30.43,45 26.28,45 arc-90 18.28,53 SX3.7
N$14
  Top 1.272: SX2.2 81.6,22.36 arc-90 76.6,27.36 76.6,28.14 arc45 75.14,31.68 R14.1 69.46,36.6 arc-45 68,40.14 Z4.2
N$15
  Top 1.272: J13.1 19.67,93.46 arc45 23.21,92 24.15,92 arc45 27.69,93.46 C12O.1
N$16
  Top 1.272: R3O.1 arc45 25.02,46.08 26.56,44.54 arc45 30.09,43.08 R8.2 36.85,53.95 arc45 35.39,57.48 C2O.2
N$17
  Top 1.272: R3O1.1 arc-45 84.98,46.08 83.44,44.54 arc-45 79.91,43.08 R14.2 73.14,53.95 arc-45 74.61,57.48 C2O1.2
N$18
  Top 1.272: C21O.2 31.33,10.08 arc45 34.86,11.54 D3.1
  Bottom 1.272: SX1.1 26.24,34.74 arc45 24.77,31.2 SX1.8 24.77,18.53 arc45 26.24,14.99 C21O.2
N$19
  Top 1.272: C12O.2 37.54,93.03 arc-45 R20O.1 30.19,82.11 arc-45 26.65,80.65 R18O.2
N$20
  Bottom 1.272: C15O.2 arc-45 105.8,95.4 105.8,69.94 arc45 107.26,66.41 R28O.2 R24O.2
N$21
  Bottom 1.272: C13O.1 arc45 15.12,94.21 J13.4
N$22
  Top 2.54: SX3.3 18.28,67.7 arc-45 16.82,64.16 SX3.6 10.36,57.71 arc45 8.9,54.17 8.9,41.83 arc-45 U1.3 | D2.1 D1.1
  Bottom 2.54: SX3.3 20.98,73.84 arc90 26.64,73.84 28.38,75.58 arc-90 32.62,75.58 33.29,74.91 arc45 36.82,73.45 D1.1
N$23
  Top 1.272: R7.1 17.12,48.97 arc-90 17.12,45.96 arc45 15.66,42.43 15.66,27.06 arc45 17.12,23.53 SX1.7 24.26,28.35 arc-45 27.8,29.81 32.21,29.81 arc-45 35.74,28.35 D3.2
N$24
  Top 1.272: J13.3 24.26,93.96 arc45 C14O.1
N$25
  Top 1.272: R11O.1 arc-45 8.99,92.1 17.04,92.1 arc-45 18.45,91.51 19.1,90.87 arc45 20.52,90.28 C14O.2 R16O.2
N$26
  Top 1.272: SX1.3 23.43,37.19 arc45 26.97,35.72 37,35.72 arc-90 42,30.72 Z3.1 R9.2
N$27
  Bottom 1.272: Z4.1 R15.2 arc90 70.73,23 73.24,23 arc90 75,24.76 arc-45 75.88,26.88 78,29 arc-90 85.08,29 SX2.3
N$28
  Top 1.272: R14O.2 arc-45 14.08,87.36 C13O.2 13.27,89.46 arc-45 9.73,88 6.38,88 arc-45 2.85,89.46 R21O.2
N$29
  Bottom 1.272: D6.2 arc-45 73.06,29.15 76.72,32.81 arc-45 80.25,34.27 81.58,34.27 arc45 85.12,35.74 SX2.7 91.72,45.74 arc-45 93.18,49.27 R13.1
N$30
  Top 1.272: J2.1 C24O.1
N$31
  Top 1.272: C24O.2 72.71,93.63 arc45 R29O.1 79.81,82.11 arc45 83.35,80.65 R23O.2
N$32
  Top 1.272: J2.4 arc45 93.08,96.62 C25O.1
N$33
  Top 1.272: C26O.1 87.8,96.62 arc45 J2.3
N$34
  Top 1.272: R22O.1 arc45 101.25,92 88.75,92 arc45 85.21,90.54 C26O.2 R26O.2
N$35
  Bottom 1.272: R5.1 29.77,47.2 arc45 33.3,48.67 35.84,51.2 arc45 37.3,54.73 37.3,58.77 arc45 35.84,62.31 31.49,66.66 arc-45 30.02,70.19 SX3.1
N$36
  Top 1.272: R25O.2 arc45 95.92,87.36 C25O.2 96.73,89.46 arc45 100.27,88 103.62,88 arc45 107.15,89.46 R30O.2
N$37
  Top 1.272: R10.2 U1.2 U1.4
N$38
  Top 1.272: R16.2 U2.2 U2.4
R+
  Top 1.272: R18O.1 13.36,80.65 arc45 9.82,79.18 R12O.1 5.76,75.13 arc45 4.3,71.59 4.3,56.04 arc-45 2.84,52.5 R2.2
R-
  Top 1.272: R1.2 34.75,77.97 arc-45 R16O.1 arc-45 31.16,79 25,79 arc-90 23,81 arc-45 24.16,83.8 R14O.1
R_OUT
  Top 1.272: J3.3 38.56,6.46 arc-45 35.03,5 10.8,5 arc-45 7.26,6.46 C21O.1